# Altium schematic sheet Sheet2.SchDoc
size A4
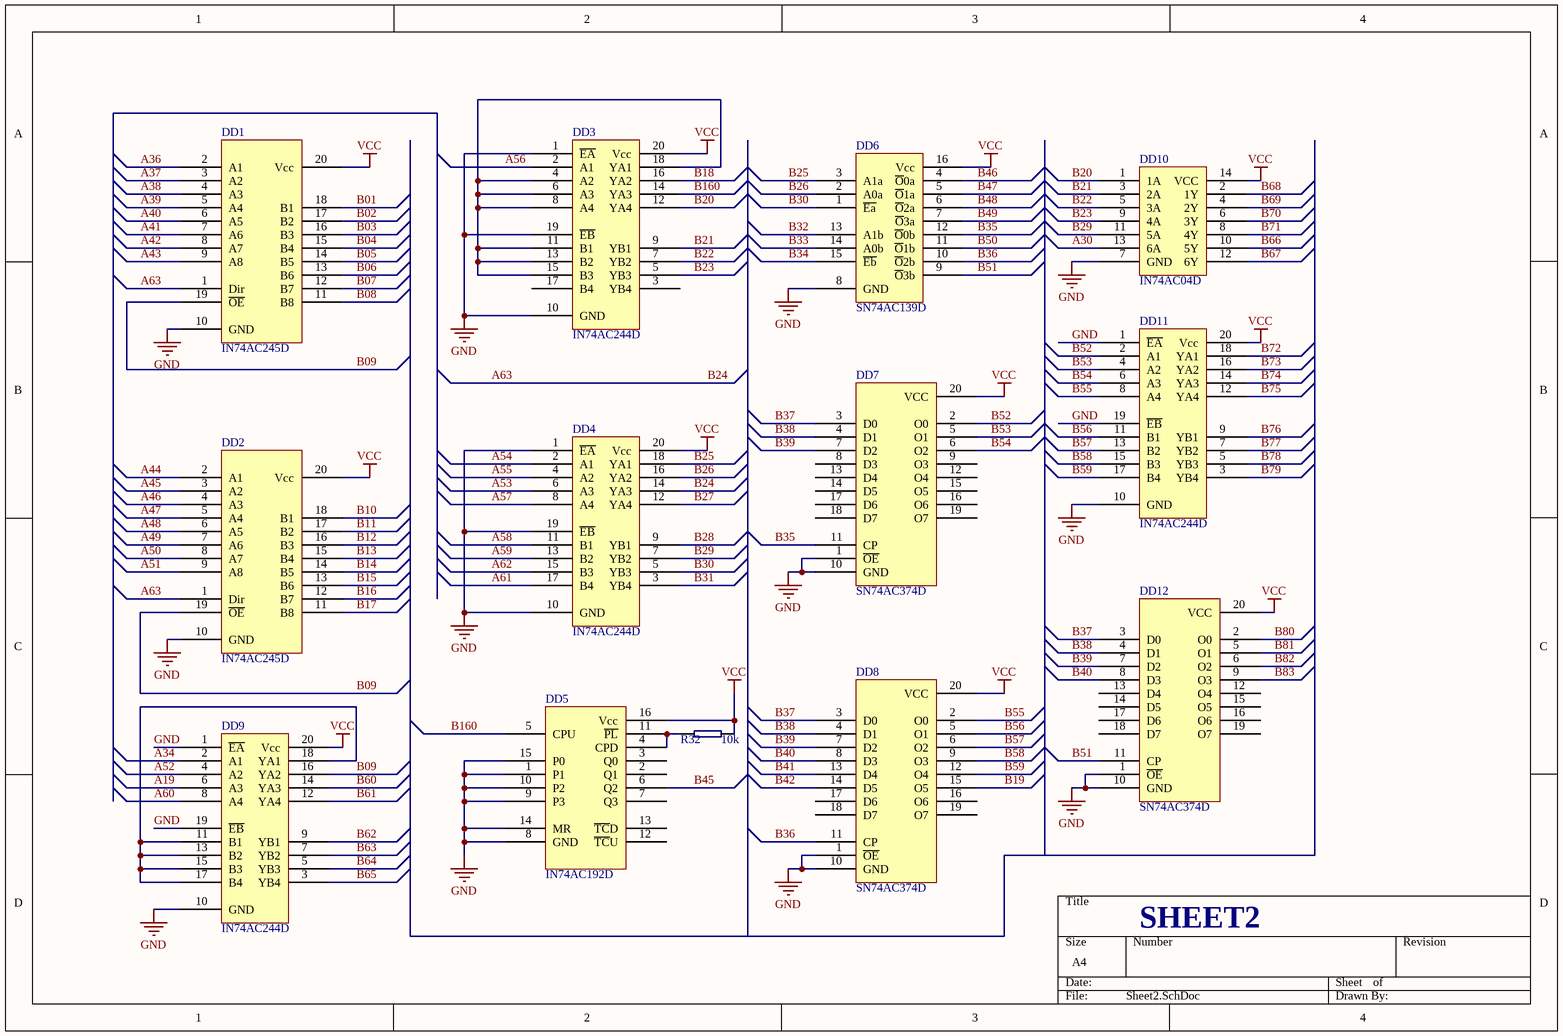
[diagram p0: Sheet2.SchDoc]

## Parts
DD1  IN74AC245D  [20 SSOP-4.4]
DD2  IN74AC245D  [20 SSOP-4.4]
DD3  IN74AC244D  [20 SOIC-7.5]
DD4  IN74AC244D  [20 SOIC-7.5]
DD5  IN74AC192D  [16 SOIC-3.9]
DD6  SN74AC139D  [16 SOIC-3.9]
DD7  SN74AC374D  [20 SOIC-7.5]
DD8  SN74AC374D  [20 SOIC-7.5]
DD9  IN74AC244D  [20 SOIC-7.5]
DD10  IN74AC04D  [14 SOIC-3.9]
DD11  IN74AC244D  [20 SOIC-7.5]
DD12  SN74AC374D  [20 SOIC-7.5]
R32  value 10k  [0805]  (hidden comment: R)

## Nets
GND: DD1.10(GND) DD2.10(GND) DD3.1(~{EA}) DD3.10(GND) DD3.19(~{EB}) DD4.1(~{EA}) DD4.10(GND) DD4.19(~{EB}) DD5.1(P1) DD5.8(GND) DD5.9(P3) DD5.10(P2) DD5.14(MR) DD5.15(P0) DD6.8(GND) DD7.1(~{OE}) DD7.10(GND) DD8.1(~{OE}) DD8.10(GND) DD9.1(~{EA}) DD9.10(GND) DD9.19(~{EB}) DD10.7(GND) DD11.1(~{EA}) DD11.10(GND) DD11.19(~{EB}) DD12.1(~{OE}) DD12.10(GND)
VCC: DD1.20(Vcc) DD2.20(Vcc) DD3.20(Vcc) DD4.20(Vcc) DD5.16(Vcc) DD6.16(Vcc) DD7.20(VCC) DD8.20(VCC) DD9.20(Vcc) DD10.14(VCC) DD11.20(Vcc) DD12.20(VCC) R32.2
A19: DD9.6(A3)
A30: DD10.13(6A)
A34: DD9.2(A1)
A36: DD1.2(A1)
A37: DD1.3(A2)
A38: DD1.4(A3)
A39: DD1.5(A4)
A40: DD1.6(A5)
A41: DD1.7(A6)
A42: DD1.8(A7)
A43: DD1.9(A8)
A44: DD2.2(A1)
A45: DD2.3(A2)
A46: DD2.4(A3)
A47: DD2.5(A4)
A48: DD2.6(A5)
A49: DD2.7(A6)
A50: DD2.8(A7)
A51: DD2.9(A8)
A52: DD9.4(A2)
A53: DD4.6(A3)
A54: DD4.2(A1)
A55: DD4.4(A2)
A56: DD3.2(A1)
A57: DD4.8(A4)
A58: DD4.11(B1)
A59: DD4.13(B2)
A60: DD9.8(A4)
A61: DD4.17(B4)
A62: DD4.15(B3)
A63: DD1.1(Dir) DD2.1(Dir) DD4.14(YA3)  [also labelled B24]
B01: DD1.18(B1)
B02: DD1.17(B2)
B03: DD1.16(B3)
B04: DD1.15(B4)
B05: DD1.14(B5)
B06: DD1.13(B6)
B07: DD1.12(B7)
B08: DD1.11(B8)
B09: DD1.19(~{OE}) DD2.19(~{OE}) DD9.16(YA2)
B10: DD2.18(B1)
B11: DD2.17(B2)
B12: DD2.16(B3)
B13: DD2.15(B4)
B14: DD2.14(B5)
B15: DD2.13(B6)
B16: DD2.12(B7)
B17: DD2.11(B8)
B18: DD3.16(YA2)
B19: DD8.15(O5)
B20: DD3.12(YA4) DD10.1(1A)
B21: DD3.9(YB1) DD10.3(2A)
B22: DD3.7(YB2) DD10.5(3A)
B23: DD3.5(YB3) DD10.9(4A)
B25: DD4.18(YA1) DD6.3(A1a)
B26: DD4.16(YA2) DD6.2(A0a)
B27: DD4.12(YA4)
B28: DD4.9(YB1)
B29: DD4.7(YB2) DD10.11(5A)
B30: DD4.5(YB3) DD6.1(~{Ea})
B31: DD4.3(YB4)
B32: DD6.13(A1b)
B33: DD6.14(A0b)
B34: DD6.15(~{Eb})
B35: DD6.12(~{O}0b) DD7.11(CP)
B36: DD6.10(~{O}2b) DD8.11(CP)
B37: DD7.3(D0) DD8.3(D0) DD12.3(D0)
B38: DD7.4(D1) DD8.4(D1) DD12.4(D1)
B39: DD7.7(D2) DD8.7(D2) DD12.7(D2)
B40: DD8.8(D3) DD12.8(D3)
B41: DD8.13(D4)
B42: DD8.14(D5)
B45: DD5.6(Q2)
B46: DD6.4(~{O}0a)
B47: DD6.5(~{O}1a)
B48: DD6.6(~{O}2a)
B49: DD6.7(~{O}3a)
B50: DD6.11(~{O}1b)
B51: DD6.9(~{O}3b) DD12.11(CP)
B52: DD7.2(O0) DD11.2(A1)
B53: DD7.5(O1) DD11.4(A2)
B54: DD7.6(O2) DD11.6(A3)
B55: DD8.2(O0) DD11.8(A4)
B56: DD8.5(O1) DD11.11(B1)
B57: DD8.6(O2) DD11.13(B2)
B58: DD8.9(O3) DD11.15(B3)
B59: DD8.12(O4) DD11.17(B4)
B60: DD9.14(YA3)
B61: DD9.12(YA4)
B62: DD9.9(YB1)
B63: DD9.7(YB2)
B64: DD9.5(YB3)
B65: DD9.3(YB4)
B66: DD10.10(5Y)
B67: DD10.12(6Y)
B68: DD10.2(1Y)
B69: DD10.4(2Y)
B70: DD10.6(3Y)
B71: DD10.8(4Y)
B72: DD11.18(YA1)
B73: DD11.16(YA2)
B74: DD11.14(YA3)
B75: DD11.12(YA4)
B76: DD11.9(YB1)
B77: DD11.7(YB2)
B78: DD11.5(YB3)
B79: DD11.3(YB4)
B80: DD12.2(O0)
B81: DD12.5(O1)
B82: DD12.6(O2)
B83: DD12.9(O3)
B160: DD3.14(YA3) DD5.5(CPU)
NetDD3_4: DD3.4(A2) DD3.6(A3) DD3.8(A4) DD3.11(B1) DD3.13(B2) DD3.15(B3) DD3.18(YA1)
NetDD5_4: DD5.4(CPD) DD5.11(~{PL}) R32.1
NetDD9_11: DD9.11(B1) DD9.13(B2) DD9.15(B3) DD9.17(B4) DD9.18(YA1)

Not connected (* = marked no-connect by the designer): DD3 3(YB4) 17(B4); DD5 2(Q1) 3(Q0) 7(Q3) 12(~{TC}U) 13(~{TC}D); DD7 8(D3) 9(O3) 12(O4) 13(D4) 14(D5) 15(O5) 16(O6) 17(D6) 18(D7) 19(O7); DD8 16(O6) 17(D6) 18(D7) 19(O7); DD12 12(O4) 13(D4) 14(D5) 15(O5) 16(O6) 17(D6) 18(D7) 19(O7)

## Notes on the sheet
- SHEET2